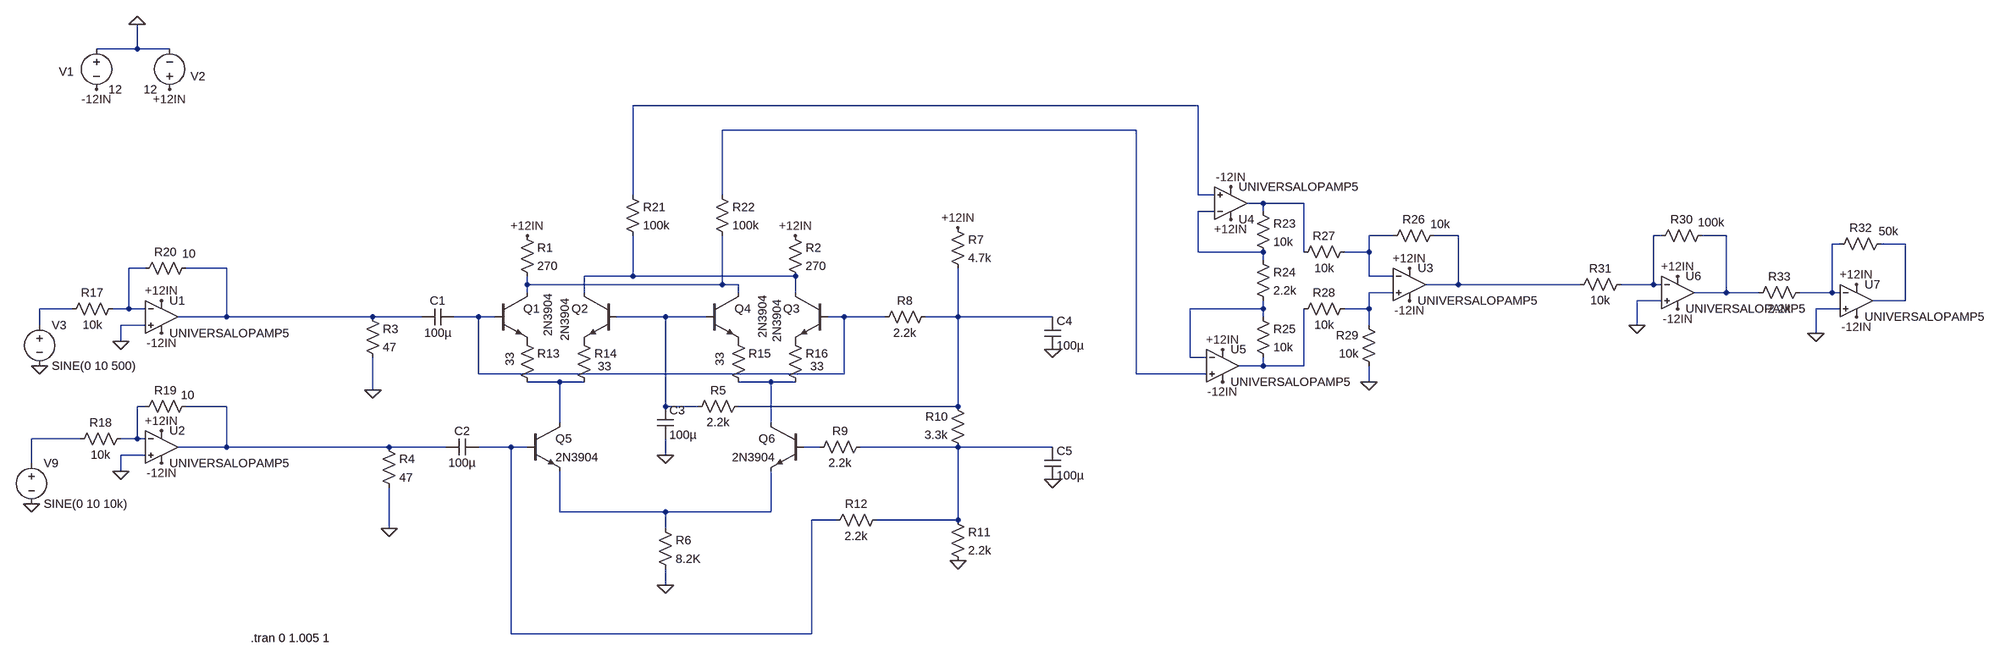
[diagram p0: schematic Gilbert cell multiplier.asc]
Gilbert cell multiplier.asc, the LTspice schematic file:
Version 4.1
SHEET 1 2980 680
WIRE -640 -1328 -640 -1376
WIRE -640 -1328 -720 -1328
WIRE -576 -1328 -640 -1328
WIRE 1584 -1216 336 -1216
WIRE 1440 -1168 512 -1168
WIRE 336 -1040 336 -1216
WIRE 512 -1040 512 -1168
WIRE 1584 -1040 1584 -1216
WIRE 1616 -1040 1584 -1040
WIRE 1712 -1024 1680 -1024
WIRE 1792 -1024 1712 -1024
WIRE 1616 -1008 1584 -1008
WIRE 1712 -1008 1712 -1024
WIRE 1968 -960 1920 -960
WIRE 2096 -960 2048 -960
WIRE 2496 -960 2480 -960
WIRE 2624 -960 2576 -960
WIRE 2848 -944 2832 -944
WIRE 2976 -944 2928 -944
WIRE 1584 -928 1584 -1008
WIRE 1712 -928 1584 -928
WIRE 1792 -928 1792 -1024
WIRE 1920 -928 1920 -960
WIRE 1920 -928 1872 -928
WIRE 1712 -912 1712 -928
WIRE -624 -896 -656 -896
WIRE -464 -896 -544 -896
WIRE 336 -880 336 -960
WIRE 336 -880 240 -880
WIRE 656 -880 336 -880
WIRE 1920 -880 1920 -928
WIRE 1968 -880 1920 -880
WIRE 128 -864 128 -880
WIRE 512 -864 512 -960
WIRE 512 -864 128 -864
WIRE 544 -864 512 -864
WIRE 2096 -864 2096 -960
WIRE 2096 -864 2032 -864
WIRE 2336 -864 2096 -864
WIRE 2480 -864 2480 -960
WIRE 2480 -864 2416 -864
WIRE 2496 -864 2480 -864
WIRE 128 -848 128 -864
WIRE 240 -848 240 -880
WIRE 544 -848 544 -864
WIRE 656 -848 656 -880
WIRE 1968 -848 1920 -848
WIRE 2624 -848 2624 -960
WIRE 2624 -848 2560 -848
WIRE 2688 -848 2624 -848
WIRE 2832 -848 2832 -944
WIRE 2832 -848 2768 -848
WIRE 2848 -848 2832 -848
WIRE 2496 -832 2448 -832
WIRE 2976 -832 2976 -944
WIRE 2976 -832 2912 -832
WIRE -768 -816 -832 -816
WIRE -656 -816 -656 -896
WIRE -656 -816 -688 -816
WIRE -624 -816 -656 -816
WIRE 1712 -816 1712 -832
WIRE 1712 -816 1568 -816
WIRE 1920 -816 1920 -848
WIRE 1920 -816 1872 -816
WIRE 2848 -816 2800 -816
WIRE -464 -800 -464 -896
WIRE -464 -800 -560 -800
WIRE -176 -800 -464 -800
WIRE -80 -800 -176 -800
WIRE 32 -800 -16 -800
WIRE 64 -800 32 -800
WIRE 400 -800 304 -800
WIRE 480 -800 400 -800
WIRE 752 -800 720 -800
WIRE 832 -800 752 -800
WIRE 976 -800 976 -896
WIRE 976 -800 912 -800
WIRE 1184 -800 976 -800
WIRE 1712 -800 1712 -816
WIRE -832 -784 -832 -816
WIRE -624 -784 -672 -784
WIRE 1920 -784 1920 -816
WIRE 2448 -784 2448 -832
WIRE 2800 -768 2800 -816
WIRE -672 -752 -672 -784
WIRE 1568 -720 1568 -816
WIRE 1600 -720 1568 -720
WIRE 1712 -704 1712 -720
WIRE 1712 -704 1664 -704
WIRE 1792 -704 1792 -816
WIRE 1792 -704 1712 -704
WIRE 32 -688 32 -800
WIRE 752 -688 752 -800
WIRE 752 -688 32 -688
WIRE 1440 -688 1440 -1168
WIRE 1600 -688 1440 -688
WIRE 192 -672 128 -672
WIRE 240 -672 192 -672
WIRE 608 -672 544 -672
WIRE 656 -672 608 -672
WIRE 1920 -672 1920 -704
WIRE -176 -656 -176 -720
WIRE -624 -624 -640 -624
WIRE -464 -624 -544 -624
WIRE 400 -624 400 -800
WIRE 464 -624 400 -624
WIRE 976 -624 976 -800
WIRE 976 -624 544 -624
WIRE 192 -592 192 -672
WIRE 608 -592 608 -672
WIRE -752 -560 -848 -560
WIRE -640 -560 -640 -624
WIRE -640 -560 -672 -560
WIRE -624 -560 -640 -560
WIRE -464 -544 -464 -624
WIRE -464 -544 -560 -544
WIRE -144 -544 -464 -544
WIRE -32 -544 -144 -544
WIRE 96 -544 32 -544
WIRE 128 -544 96 -544
WIRE 704 -544 672 -544
WIRE 976 -544 784 -544
WIRE 1184 -544 976 -544
WIRE -624 -528 -672 -528
WIRE 400 -528 400 -560
WIRE -848 -512 -848 -560
WIRE -672 -496 -672 -528
WIRE 192 -416 192 -496
WIRE 400 -416 192 -416
WIRE 608 -416 608 -496
WIRE 608 -416 400 -416
WIRE 736 -400 688 -400
WIRE 976 -400 976 -544
WIRE 976 -400 816 -400
WIRE -144 -384 -144 -464
WIRE 400 -384 400 -416
WIRE 400 -272 400 -304
WIRE 96 -176 96 -544
WIRE 688 -176 688 -400
WIRE 688 -176 96 -176
FLAG -176 -656 0
FLAG -144 -384 0
FLAG 400 -528 0
FLAG 400 -272 0
FLAG 1184 -736 0
FLAG 1184 -480 0
FLAG 976 -320 0
FLAG -672 -752 0
FLAG -672 -496 0
FLAG -832 -704 0
FLAG -848 -432 0
FLAG 1920 -672 0
FLAG 2448 -784 0
FLAG 2800 -768 0
FLAG -576 -1248 +12IN
FLAG -720 -1248 -12IN
FLAG -640 -1376 0
FLAG -592 -832 +12IN
FLAG -592 -576 +12IN
FLAG 128 -960 +12IN
FLAG 656 -960 +12IN
FLAG 976 -976 +12IN
FLAG 1648 -992 +12IN
FLAG 1632 -736 +12IN
FLAG 2000 -896 +12IN
FLAG 2528 -880 +12IN
FLAG 2880 -864 +12IN
FLAG -592 -768 -12IN
FLAG -592 -512 -12IN
FLAG 1648 -1056 -12IN
FLAG 1632 -672 -12IN
FLAG 2000 -832 -12IN
FLAG 2528 -816 -12IN
FLAG 2880 -800 -12IN
SYMBOL npn 64 -848 R0
WINDOW 3 105 2 VRight 2
SYMATTR Value 2N3904
SYMATTR InstName Q1
SYMBOL npn 304 -848 M0
WINDOW 3 101 96 VLeft 2
SYMATTR Value 2N3904
SYMATTR InstName Q2
SYMBOL npn 720 -848 M0
WINDOW 3 100 98 VLeft 2
SYMATTR Value 2N3904
SYMATTR InstName Q3
SYMBOL npn 480 -848 R0
WINDOW 3 112 5 VRight 2
SYMATTR Value 2N3904
SYMATTR InstName Q4
SYMBOL npn 128 -592 R0
SYMATTR InstName Q5
SYMATTR Value 2N3904
SYMBOL npn 672 -592 M0
SYMATTR InstName Q6
SYMATTR Value 2N3904
SYMBOL res 112 -976 R0
SYMATTR InstName R1
SYMATTR Value 270
SYMBOL res 640 -976 R0
SYMATTR InstName R2
SYMATTR Value 270
SYMBOL cap -16 -816 R90
WINDOW 0 0 32 VBottom 2
WINDOW 3 32 32 VTop 2
SYMATTR InstName C1
SYMATTR Value 100µ
SYMBOL cap 32 -560 R90
WINDOW 0 0 32 VBottom 2
WINDOW 3 32 32 VTop 2
SYMATTR InstName C2
SYMATTR Value 100µ
SYMBOL res -192 -816 R0
SYMATTR InstName R3
SYMATTR Value 47
SYMBOL res -160 -560 R0
SYMATTR InstName R4
SYMATTR Value 47
SYMBOL cap 384 -624 R0
SYMATTR InstName C3
SYMATTR Value 100µ
SYMBOL res 560 -640 R90
WINDOW 0 0 56 VBottom 2
WINDOW 3 32 56 VTop 2
SYMATTR InstName R5
SYMATTR Value 2.2k
SYMBOL res 384 -400 R0
SYMATTR InstName R6
SYMATTR Value 8.2K
SYMBOL res 960 -992 R0
SYMATTR InstName R7
SYMATTR Value 4.7k
SYMBOL res 928 -816 R90
WINDOW 0 0 56 VBottom 2
WINDOW 3 32 56 VTop 2
SYMATTR InstName R8
SYMATTR Value 2.2k
SYMBOL res 800 -560 R90
WINDOW 0 0 56 VBottom 2
WINDOW 3 32 56 VTop 2
SYMATTR InstName R9
SYMATTR Value 2.2k
SYMBOL res 992 -528 R180
WINDOW 0 36 76 Left 2
WINDOW 3 36 40 Left 2
SYMATTR InstName R10
SYMATTR Value 3.3k
SYMBOL cap 1168 -800 R0
SYMATTR InstName C4
SYMATTR Value 100µ
SYMBOL cap 1168 -544 R0
SYMATTR InstName C5
SYMATTR Value 100µ
SYMBOL res 960 -416 R0
SYMATTR InstName R11
SYMATTR Value 2.2k
SYMBOL res 832 -416 R90
WINDOW 0 0 56 VBottom 2
WINDOW 3 32 56 VTop 2
SYMATTR InstName R12
SYMATTR Value 2.2k
SYMBOL res 112 -768 R0
WINDOW 3 -18 38 VRight 2
SYMATTR Value 33
SYMATTR InstName R13
SYMBOL res 224 -768 R0
WINDOW 3 43 65 Left 2
SYMATTR Value 33
SYMATTR InstName R14
SYMBOL res 528 -768 R0
WINDOW 3 -20 38 VRight 2
SYMATTR Value 33
SYMATTR InstName R15
SYMBOL res 640 -768 R0
WINDOW 3 45 65 Left 2
SYMATTR Value 33
SYMATTR InstName R16
SYMBOL OpAmps\\UniversalOpAmp5 -592 -800 R0
SYMATTR InstName U1
SYMBOL OpAmps\\UniversalOpAmp5 -592 -544 R0
SYMATTR InstName U2
SYMBOL res -672 -832 R90
WINDOW 0 0 56 VBottom 2
WINDOW 3 32 56 VTop 2
SYMATTR InstName R17
SYMATTR Value 10k
SYMBOL res -656 -576 R90
WINDOW 0 0 56 VBottom 2
WINDOW 3 32 56 VTop 2
SYMATTR InstName R18
SYMATTR Value 10k
SYMBOL res -528 -640 R90
WINDOW 0 0 56 VBottom 2
WINDOW 3 -22 12 VTop 2
SYMATTR InstName R19
SYMATTR Value 10
SYMBOL res -528 -912 R90
WINDOW 0 0 56 VBottom 2
WINDOW 3 -28 10 VTop 2
SYMATTR InstName R20
SYMATTR Value 10
SYMBOL voltage -832 -800 R0
WINDOW 123 0 0 Left 0
WINDOW 39 0 0 Left 0
SYMATTR InstName V3
SYMATTR Value SINE(0 10 500)
SYMBOL voltage -848 -528 R0
WINDOW 123 0 0 Left 0
WINDOW 39 0 0 Left 0
SYMATTR InstName V9
SYMATTR Value SINE(0 10 10k)
SYMBOL res 320 -1056 R0
SYMATTR InstName R21
SYMATTR Value 100k
SYMBOL res 496 -1056 R0
SYMATTR InstName R22
SYMATTR Value 100k
SYMBOL res 1696 -1024 R0
SYMATTR InstName R23
SYMATTR Value 10k
SYMBOL res 1696 -928 R0
SYMATTR InstName R24
SYMATTR Value 2.2k
SYMBOL res 1696 -816 R0
SYMATTR InstName R25
SYMATTR Value 10k
SYMBOL res 2064 -976 R90
WINDOW 0 0 56 VBottom 2
WINDOW 3 -22 3 VTop 2
SYMATTR InstName R26
SYMATTR Value 10k
SYMBOL res 1888 -944 R90
WINDOW 0 0 56 VBottom 2
WINDOW 3 32 56 VTop 2
SYMATTR InstName R27
SYMATTR Value 10k
SYMBOL res 1888 -832 R90
WINDOW 0 0 56 VBottom 2
WINDOW 3 32 56 VTop 2
SYMATTR InstName R28
SYMATTR Value 10k
SYMBOL res 1936 -688 R180
WINDOW 0 36 76 Left 2
WINDOW 3 36 40 Left 2
SYMATTR InstName R29
SYMATTR Value 10k
SYMBOL OpAmps\\UniversalOpAmp5 2000 -864 R0
SYMATTR InstName U3
SYMBOL OpAmps\\UniversalOpAmp5 1648 -1024 M180
SYMATTR InstName U4
SYMBOL OpAmps\\UniversalOpAmp5 1632 -704 R0
SYMATTR InstName U5
SYMBOL OpAmps\\UniversalOpAmp5 2528 -848 R0
SYMATTR InstName U6
SYMBOL res 2592 -976 R90
WINDOW 0 0 56 VBottom 2
WINDOW 3 -26 -2 VTop 2
SYMATTR InstName R30
SYMATTR Value 100k
SYMBOL res 2432 -880 R90
WINDOW 0 0 56 VBottom 2
WINDOW 3 32 56 VTop 2
SYMATTR InstName R31
SYMATTR Value 10k
SYMBOL OpAmps\\UniversalOpAmp5 2880 -832 R0
SYMATTR InstName U7
SYMBOL res 2944 -960 R90
WINDOW 0 0 56 VBottom 2
WINDOW 3 -24 1 VTop 2
SYMATTR InstName R32
SYMATTR Value 50k
SYMBOL res 2784 -864 R90
WINDOW 0 0 56 VBottom 2
WINDOW 3 32 56 VTop 2
SYMATTR InstName R33
SYMATTR Value 2.2k
SYMBOL voltage -720 -1344 R0
WINDOW 0 -74 61 Left 2
WINDOW 123 0 0 Left 0
WINDOW 39 0 0 Left 0
SYMATTR InstName V1
SYMATTR Value 12
SYMBOL voltage -576 -1232 R180
WINDOW 0 -71 42 Left 2
WINDOW 3 24 16 Left 2
WINDOW 123 0 0 Left 0
WINDOW 39 0 0 Left 0
SYMATTR InstName V2
SYMATTR Value 12
TEXT -416 -168 Left 2 !.tran 0 1.005 1

The netlist it stands for:
* Gilbert cell multiplier.asc
Q1 N014 N018 P001 0 2N3904
Q2 N013 N019 P002 0 2N3904
Q3 N013 N018 P003 0 2N3904
Q4 N014 N019 P004 0 2N3904
Q5 N022 N027 N030 0 2N3904
Q6 N023 N028 N030 0 2N3904
R1 +12IN N014 270
R2 +12IN N013 270
C1 N018 N012 100µ
C2 N027 N025 100µ
R3 N012 0 47
R4 N025 0 47
C3 N019 0 100µ
R5 N020 N019 2.2k
R6 N030 0 8.2K
R7 +12IN N020 4.7k
R8 N020 N018 2.2k
R9 N029 N028 2.2k
R10 N029 N020 3.3k
C4 N020 0 100µ
C5 N029 0 100µ
R11 N029 0 2.2k
R12 N029 N027 2.2k
R13 P001 N022 33
R14 P002 N022 33
R15 P004 N023 33
R16 P003 N023 33
X§U1 0 N011 +12IN -12IN N012 level5 Avol=1Meg GBW=10Meg Phimargin=45 SlewPos=10Meg SlewNeg=10Meg En=0 Enk=0 In=0 Ink=0 Rcm=500Meg Ccm=1p Rdiff=500k Cdiff=2p Ro=1k Vos=0 Ibp=2n Ibn=1n Iq=1m Rail=0 Ilimit=25m  ; UNIVERSALOPAMP5, pins In+ In- V+ V- OUT
X§U2 0 N024 +12IN -12IN N025 level5 Avol=1Meg GBW=10Meg Phimargin=45 SlewPos=10Meg SlewNeg=10Meg En=0 Enk=0 In=0 Ink=0 Rcm=500Meg Ccm=1p Rdiff=500k Cdiff=2p Ro=1k Vos=0 Ibp=2n Ibn=1n Iq=1m Rail=0 Ilimit=25m  ; UNIVERSALOPAMP5, pins In+ In- V+ V- OUT
R17 N011 N016 10k
R18 N024 N026 10k
R19 N025 N024 10
R20 N012 N011 10
V3 N016 0 SINE(0 10 500)
V9 N026 0 SINE(0 10 10k)
R21 N001 N013 100k
R22 N002 N014 100k
R23 N003 N004 10k
R24 N004 N017 2.2k
R25 N017 N021 10k
R26 N006 N005 10k
R27 N005 N003 10k
R28 N015 N021 10k
R29 0 N015 10k
X§U3 N015 N005 +12IN -12IN N006 level5 Avol=1Meg GBW=10Meg Phimargin=45 SlewPos=10Meg SlewNeg=10Meg En=0 Enk=0 In=0 Ink=0 Rcm=500Meg Ccm=1p Rdiff=500k Cdiff=2p Ro=1k Vos=0 Ibp=2n Ibn=1n Iq=1m Rail=0 Ilimit=25m  ; UNIVERSALOPAMP5, pins In+ In- V+ V- OUT
X§U4 N001 N004 +12IN -12IN N003 level5 Avol=1Meg GBW=10Meg Phimargin=45 SlewPos=10Meg SlewNeg=10Meg En=0 Enk=0 In=0 Ink=0 Rcm=500Meg Ccm=1p Rdiff=500k Cdiff=2p Ro=1k Vos=0 Ibp=2n Ibn=1n Iq=1m Rail=0 Ilimit=25m  ; UNIVERSALOPAMP5, pins In+ In- V+ V- OUT
X§U5 N002 N017 +12IN -12IN N021 level5 Avol=1Meg GBW=10Meg Phimargin=45 SlewPos=10Meg SlewNeg=10Meg En=0 Enk=0 In=0 Ink=0 Rcm=500Meg Ccm=1p Rdiff=500k Cdiff=2p Ro=1k Vos=0 Ibp=2n Ibn=1n Iq=1m Rail=0 Ilimit=25m  ; UNIVERSALOPAMP5, pins In+ In- V+ V- OUT
X§U6 0 N007 +12IN -12IN N008 level5 Avol=1Meg GBW=10Meg Phimargin=45 SlewPos=10Meg SlewNeg=10Meg En=0 Enk=0 In=0 Ink=0 Rcm=500Meg Ccm=1p Rdiff=500k Cdiff=2p Ro=1k Vos=0 Ibp=2n Ibn=1n Iq=1m Rail=0 Ilimit=25m  ; UNIVERSALOPAMP5, pins In+ In- V+ V- OUT
R30 N008 N007 100k
R31 N007 N006 10k
X§U7 0 N009 +12IN -12IN N010 level5 Avol=1Meg GBW=10Meg Phimargin=45 SlewPos=10Meg SlewNeg=10Meg En=0 Enk=0 In=0 Ink=0 Rcm=500Meg Ccm=1p Rdiff=500k Cdiff=2p Ro=1k Vos=0 Ibp=2n Ibn=1n Iq=1m Rail=0 Ilimit=25m  ; UNIVERSALOPAMP5, pins In+ In- V+ V- OUT
R32 N010 N009 50k
R33 N009 N008 2.2k
V1 0 -12IN 12
V2 +12IN 0 12
.model NPN NPN
.model PNP PNP
.lib standard.bjt
.tran 0 1.005 1
.backanno
.end